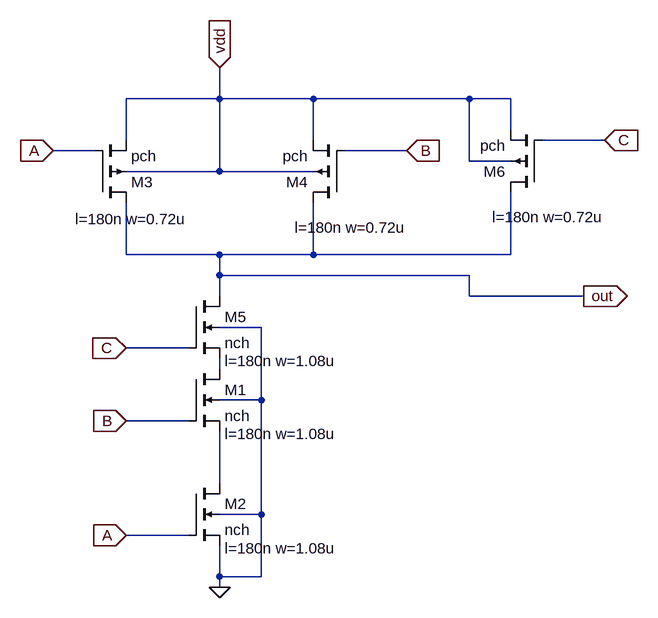
[diagram p0: schematic NAND_3.asc]
NAND_3.asc, the LTspice schematic file:
Version 4
SHEET 1 1640 836
WIRE 544 64 544 16
WIRE 544 64 400 64
WIRE 688 64 544 64
WIRE 928 64 688 64
WIRE 992 64 928 64
WIRE 992 112 992 64
WIRE 400 128 400 64
WIRE 688 128 688 64
WIRE 1136 128 1040 128
WIRE 352 144 288 144
WIRE 832 144 736 144
WIRE 928 160 928 64
WIRE 992 160 928 160
WIRE 544 176 544 64
WIRE 544 176 400 176
WIRE 688 176 544 176
WIRE 400 304 400 224
WIRE 544 304 400 304
WIRE 688 304 688 224
WIRE 688 304 544 304
WIRE 992 304 992 208
WIRE 992 304 688 304
WIRE 544 336 544 304
WIRE 928 336 544 336
WIRE 544 368 544 336
WIRE 928 368 928 336
WIRE 1104 368 928 368
WIRE 608 416 544 416
WIRE 496 448 400 448
WIRE 544 480 544 464
WIRE 608 528 608 416
WIRE 608 528 544 528
WIRE 496 560 400 560
WIRE 544 656 544 576
WIRE 608 704 608 528
WIRE 608 704 544 704
WIRE 496 736 400 736
WIRE 544 800 544 752
WIRE 608 800 608 704
WIRE 608 800 544 800
WIRE 544 816 544 800
FLAG 1104 368 out
IOPIN 1104 368 Out
FLAG 544 816 0
FLAG 544 16 vdd
IOPIN 544 16 In
FLAG 288 144 A
IOPIN 288 144 In
FLAG 400 736 A
IOPIN 400 736 In
FLAG 400 560 B
IOPIN 400 560 In
FLAG 832 144 B
IOPIN 832 144 In
FLAG 400 448 C
IOPIN 400 448 In
FLAG 1136 128 C
IOPIN 1136 128 In
SYMBOL nmos4 496 656 R0
WINDOW 123 56 100 Left 2
SYMATTR Value2 l=180n w=1.08u
SYMATTR InstName M2
SYMATTR Value nch
SYMBOL nmos4 496 480 R0
WINDOW 123 56 100 Left 2
SYMATTR Value2 l=180n w=1.08u
SYMATTR InstName M1
SYMATTR Value nch
SYMBOL pmos4 352 224 M180
WINDOW 123 -30 -25 Left 2
SYMATTR Value2 l=180n w=0.72u
SYMATTR InstName M3
SYMATTR Value pch
SYMBOL pmos4 736 224 R180
WINDOW 123 -96 -38 Left 2
SYMATTR Value2 l=180n w=0.72u
SYMATTR InstName M4
SYMATTR Value pch
SYMBOL nmos4 496 368 R0
WINDOW 123 56 100 Left 2
SYMATTR Value2 l=180n w=1.08u
SYMATTR InstName M5
SYMATTR Value nch
SYMBOL pmos4 1040 208 R180
WINDOW 123 -96 -38 Left 2
SYMATTR Value2 l=180n w=0.72u
SYMATTR InstName M6
SYMATTR Value pch

The netlist it stands for:
* NAND_3.asc
M2 N002 A 0 0 nch l=180n w=1.08u
M1 N001 B N002 0 nch l=180n w=1.08u
M3 out A vdd vdd pch l=180n w=0.72u
M4 out B vdd vdd pch l=180n w=0.72u
M5 out C N001 0 nch l=180n w=1.08u
M6 out C vdd vdd pch l=180n w=0.72u
.model NMOS NMOS
.model PMOS PMOS
.lib standard.mos
.backanno
.end